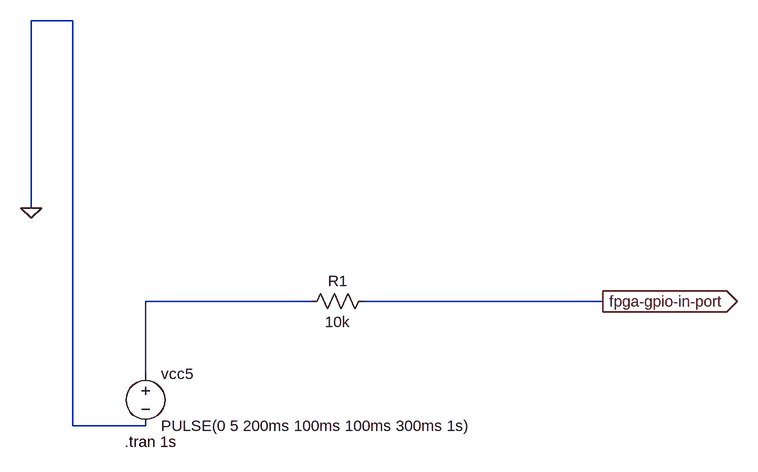
[diagram p0: schematic bread-board-5to33-test03.asc]
bread-board-5to33-test03.asc, the LTspice schematic file:
Version 4
SHEET 1 880 712
WIRE -400 -224 -464 -224
WIRE -464 64 -464 -224
WIRE -32 208 -288 208
WIRE 416 208 48 208
WIRE -288 320 -288 208
WIRE -400 400 -400 -224
WIRE -288 400 -400 400
FLAG 416 208 fpga-gpio-in-port
IOPIN 416 208 Out
FLAG -464 64 0
SYMBOL voltage -288 304 R0
WINDOW 123 0 0 Left 2
WINDOW 39 0 0 Left 2
SYMATTR InstName vcc5
SYMATTR Value PULSE(0 5 200ms 100ms 100ms 300ms 1s)
SYMBOL res -48 224 R270
WINDOW 0 32 56 VTop 2
WINDOW 3 0 56 VBottom 2
SYMATTR InstName R1
SYMATTR Value 10k
TEXT -320 424 Left 2 !.tran 1s

The netlist it stands for:
* bread-board-5to33-test03.asc
vcc5 N001 0 PULSE(0 5 200ms 100ms 100ms 300ms 1s)
R1 N001 fpga-gpio-in-port 10k
.tran 1s
.backanno
.end